# Altium schematic sheet main.SchDoc: Main
size A4; Date: 2011-10-09; Author: Artur Scholz; DocumentNumber: LibreCube LC-3102a
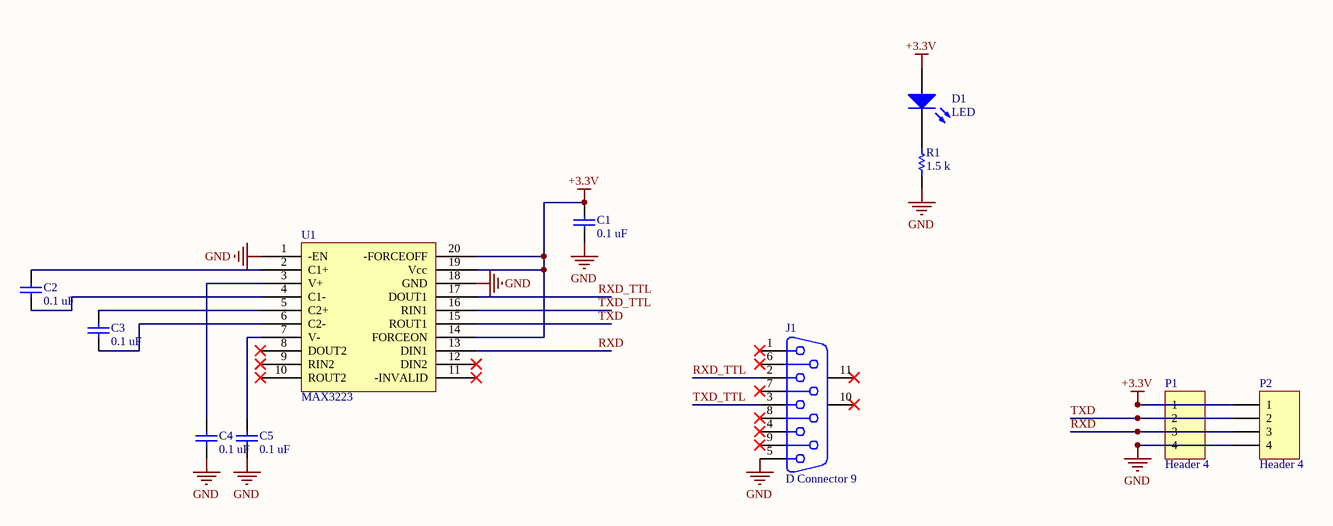
[diagram p0: main.SchDoc]

## Parts
C1  0.1 uF  [0603]
C2  0.1 uF  [0603]
C3  0.1 uF  [0603]
C4  0.1 uF  [0603]
C5  0.1 uF  [0603]
D1  LED  [0603]
J1  D Connector 9  [DSUB1.385-2H9]
P1  Header 4  [HDR1X4]
P2  Header 4  [MICRO-04-R-SMT]
R1  1.5 k  [0603]
U1  MAX3223  [TSSOP-20]

## Nets
+3.3V: C1.2 D1.1(A) P1.1 P2.1 U1.14(FORCEON) U1.19(Vcc) U1.20(-FORCEOFF)
GND: C1.1 C4.2 C5.1 J1.5 P1.4 P2.4 R1.1 U1.1(-EN) U1.18(GND)
RXD: P1.3 P2.3 U1.13(DIN1)
RXD_TTL: J1.2 U1.17(DOUT1)
TXD: P1.2 P2.2 U1.15(ROUT1)
TXD_TTL: J1.3 U1.16(RIN1)
NetC2_1: C2.1 U1.2(C1+)
NetC2_2: C2.2 U1.4(C1-)
NetC3_1: C3.1 U1.6(C2-)
NetC3_2: C3.2 U1.5(C2+)
NetC4_1: C4.1 U1.3(V+)
NetC5_2: C5.2 U1.7(V-)
NetD1_2: D1.2(K) R1.2

Not connected (* = marked no-connect by the designer): J1 1* 4* 6* 7* 8* 9* 10(MH1)* 11(MH2)*; U1 8(DOUT2)* 9(RIN2)* 10(ROUT2)* 11(-INVALID)* 12(DIN2)*

## Library data of the parts
C1-C5 = Capacitor
D1 = LED: Typical INFRARED GaAs LED
J1 = D Connector 9: Receptacle Assembly, 9 Position, Right Angle; PackageDocument: O; Positions: 9; Published: 15-Jun-2001; LatestRevisionDate: 17-Jul-2002; LatestRevisionNote: Re-released for DXP Platform.; DatasheetDocument: 1-Sep-1999; PackageReference: 788750; Publisher: Altium Limited; Orientation: Right Angle; Gender: Receptacle
P1 P2 = Header 4: Header, 4-Pin; LatestRevisionDate: 17-Jul-2002; LatestRevisionNote: Re-released for DXP Platform.; Publisher: Altium Limited
R1 = Resistor